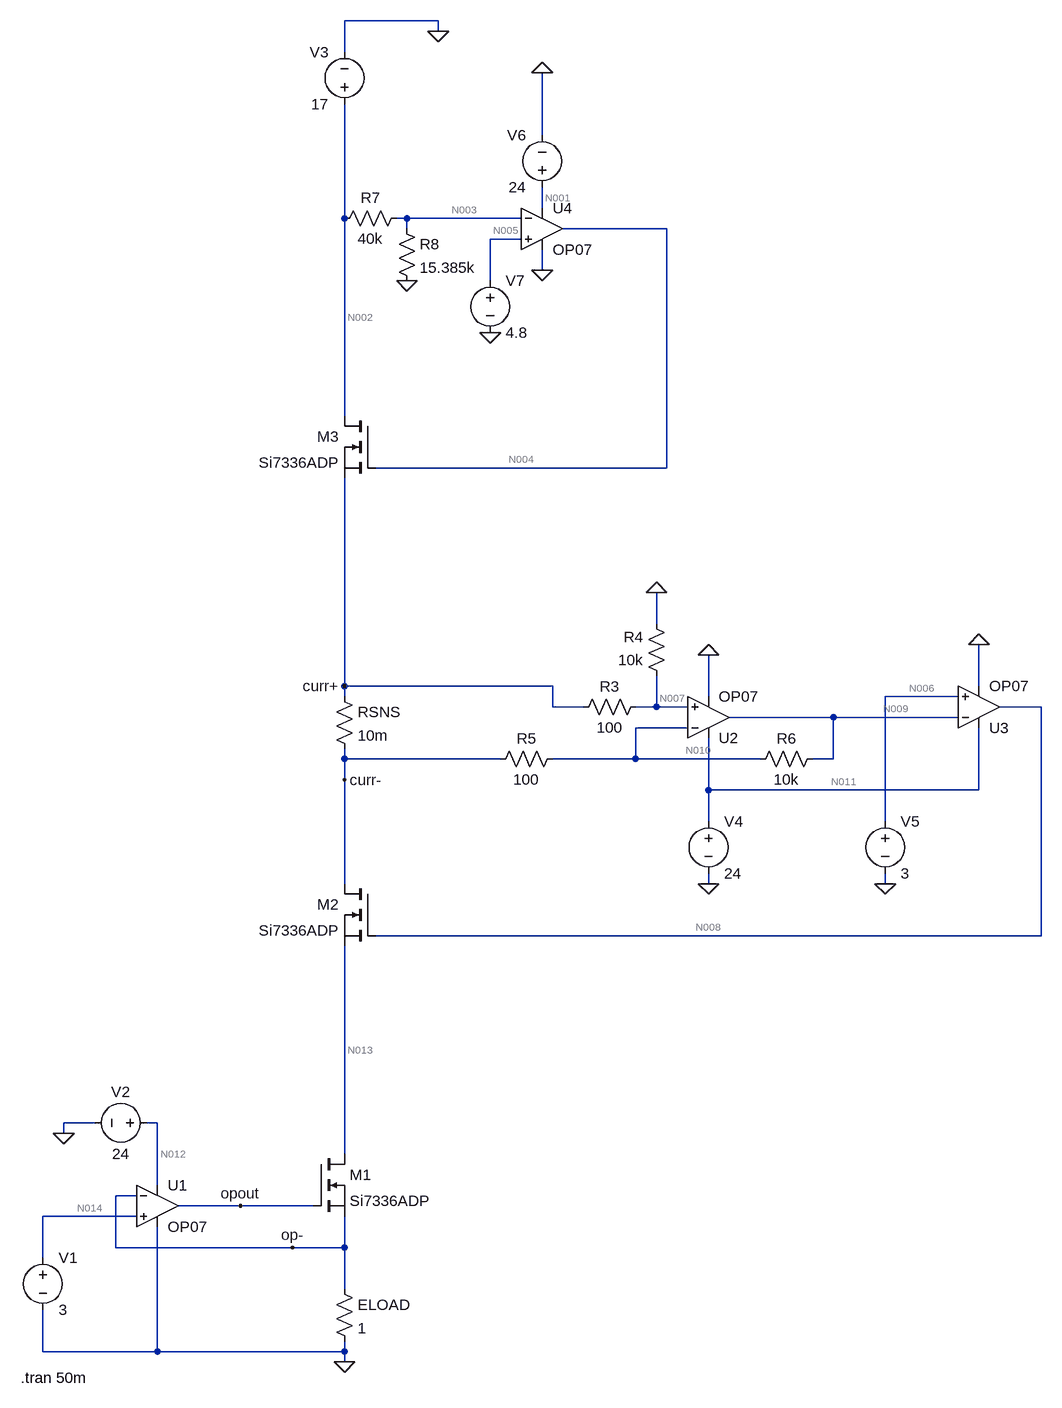
[diagram p0: schematic EloadSim.asc]
EloadSim.asc, the LTspice schematic file:
Version 4
SHEET 1 1540 680
WIRE 608 -1664 464 -1664
WIRE 608 -1648 608 -1664
WIRE 464 -1616 464 -1664
WIRE 768 -1488 768 -1584
WIRE 768 -1376 768 -1408
WIRE 464 -1360 464 -1536
WIRE 560 -1360 544 -1360
WIRE 736 -1360 560 -1360
WIRE 560 -1344 560 -1360
WIRE 960 -1344 800 -1344
WIRE 736 -1328 688 -1328
WIRE 768 -1280 768 -1312
WIRE 688 -1264 688 -1328
WIRE 464 -1056 464 -1360
WIRE 960 -976 960 -1344
WIRE 960 -976 512 -976
WIRE 944 -736 944 -784
WIRE 464 -640 464 -960
WIRE 784 -640 464 -640
WIRE 1440 -640 1440 -704
WIRE 464 -624 464 -640
WIRE 1024 -624 1024 -688
WIRE 1408 -624 1296 -624
WIRE 784 -608 784 -640
WIRE 832 -608 784 -608
WIRE 944 -608 944 -656
WIRE 944 -608 912 -608
WIRE 992 -608 944 -608
WIRE 1536 -608 1472 -608
WIRE 1216 -592 1056 -592
WIRE 1408 -592 1216 -592
WIRE 992 -576 912 -576
WIRE 464 -528 464 -544
WIRE 704 -528 464 -528
WIRE 912 -528 912 -576
WIRE 912 -528 784 -528
WIRE 1104 -528 912 -528
WIRE 1216 -528 1216 -592
WIRE 1216 -528 1184 -528
WIRE 464 -496 464 -528
WIRE 1024 -480 1024 -560
WIRE 1440 -480 1440 -576
WIRE 1440 -480 1024 -480
WIRE 1024 -432 1024 -480
WIRE 1296 -432 1296 -624
WIRE 464 -336 464 -496
WIRE 1024 -336 1024 -352
WIRE 1296 -336 1296 -352
WIRE 1536 -256 1536 -608
WIRE 1536 -256 512 -256
WIRE 80 32 32 32
WIRE 176 32 160 32
WIRE 32 48 32 32
WIRE 464 80 464 -240
WIRE 176 128 176 32
WIRE 144 144 112 144
WIRE 304 160 208 160
WIRE 416 160 304 160
WIRE 144 176 0 176
WIRE 112 224 112 144
WIRE 384 224 112 224
WIRE 464 224 464 176
WIRE 464 224 384 224
WIRE 0 240 0 176
WIRE 464 288 464 224
WIRE 0 384 0 320
WIRE 176 384 176 192
WIRE 176 384 0 384
WIRE 464 384 464 368
WIRE 464 384 176 384
WIRE 464 400 464 384
FLAG 464 400 0
FLAG 32 48 0
FLAG 608 -1648 0
FLAG 304 160 opout
FLAG 384 224 op-
FLAG 464 -640 curr+
FLAG 464 -496 curr-
FLAG 1024 -336 0
FLAG 1296 -336 0
FLAG 944 -784 0
FLAG 1024 -688 0
FLAG 1440 -704 0
FLAG 560 -1264 0
FLAG 768 -1280 0
FLAG 768 -1584 0
FLAG 688 -1184 0
SYMBOL OpAmps\\OP07 176 96 R0
SYMATTR InstName U1
SYMBOL nmos 416 80 R0
SYMATTR InstName M1
SYMATTR Value Si7336ADP
SYMBOL res 448 272 R0
SYMATTR InstName ELOAD
SYMATTR Value 1
SYMBOL voltage 0 224 R0
WINDOW 123 0 0 Left 0
WINDOW 39 0 0 Left 0
SYMATTR InstName V1
SYMATTR Value 3
SYMBOL voltage 176 32 R90
WINDOW 0 -32 56 VBottom 2
WINDOW 3 32 56 VTop 2
WINDOW 123 0 0 Left 0
WINDOW 39 0 0 Left 0
SYMATTR InstName V2
SYMATTR Value 24
SYMBOL voltage 464 -1520 R180
WINDOW 0 24 96 Left 2
WINDOW 3 24 16 Left 2
WINDOW 123 0 0 Left 0
WINDOW 39 0 0 Left 0
SYMATTR InstName V3
SYMATTR Value 17
SYMBOL res 448 -640 R0
SYMATTR InstName RSNS
SYMATTR Value 10m
SYMBOL OpAmps\\OP07 1024 -528 M180
SYMATTR InstName U2
SYMBOL voltage 1024 -448 R0
WINDOW 123 0 0 Left 0
WINDOW 39 0 0 Left 0
SYMATTR InstName V4
SYMATTR Value 24
SYMBOL res 928 -624 R90
WINDOW 0 0 56 VBottom 2
WINDOW 3 32 56 VTop 2
SYMATTR InstName R3
SYMATTR Value 100
SYMBOL res 960 -640 R180
WINDOW 0 36 76 Left 2
WINDOW 3 36 40 Left 2
SYMATTR InstName R4
SYMATTR Value 10k
SYMBOL res 800 -544 R90
WINDOW 0 0 56 VBottom 2
WINDOW 3 32 56 VTop 2
SYMATTR InstName R5
SYMATTR Value 100
SYMBOL res 1200 -544 R90
WINDOW 0 0 56 VBottom 2
WINDOW 3 32 56 VTop 2
SYMATTR InstName R6
SYMATTR Value 10k
SYMBOL OpAmps\\OP07 1440 -544 M180
SYMATTR InstName U3
SYMBOL voltage 1296 -448 R0
WINDOW 123 0 0 Left 0
WINDOW 39 0 0 Left 0
SYMATTR InstName V5
SYMATTR Value 3
SYMBOL nmos 512 -336 M0
SYMATTR InstName M2
SYMATTR Value Si7336ADP
SYMBOL res 560 -1376 R90
WINDOW 0 0 56 VBottom 2
WINDOW 3 32 56 VTop 2
SYMATTR InstName R7
SYMATTR Value 40k
SYMBOL res 544 -1360 R0
SYMATTR InstName R8
SYMATTR Value 15.385k
SYMBOL OpAmps\\OP07 768 -1408 R0
SYMATTR InstName U4
SYMBOL voltage 768 -1392 R180
WINDOW 0 24 96 Left 2
WINDOW 3 24 16 Left 2
WINDOW 123 0 0 Left 0
WINDOW 39 0 0 Left 0
SYMATTR InstName V6
SYMATTR Value 24
SYMBOL nmos 512 -1056 M0
SYMATTR InstName M3
SYMATTR Value Si7336ADP
SYMBOL voltage 688 -1280 R0
WINDOW 123 0 0 Left 0
WINDOW 39 0 0 Left 0
SYMATTR InstName V7
SYMATTR Value 4.8
TEXT -34 424 Left 2 !.tran 50m

The netlist it stands for:
* EloadSim.asc
XU1 N014 op- N012 0 opout LT1001  ; OP07, pins In+ In- V+ V- OUT
M1 N013 opout op- op- Si7336ADP
R§ELOAD op- 0 1
V1 N014 0 3
V2 N012 0 24
V3 N002 0 17
RSNS curr+ curr- 10m
XU2 N007 N010 N011 0 N009 LT1001  ; OP07, pins In+ In- V+ V- OUT
V4 N011 0 24
R3 N007 curr+ 100
R4 N007 0 10k
R5 N010 curr- 100
R6 N009 N010 10k
XU3 N006 N009 N011 0 N008 LT1001  ; OP07, pins In+ In- V+ V- OUT
V5 N006 0 3
M2 curr- N008 N013 N013 Si7336ADP
R7 N003 N002 40k
R8 N003 0 15.385k
XU4 N005 N003 N001 0 N004 LT1001  ; OP07, pins In+ In- V+ V- OUT
V6 N001 0 24
M3 N002 N004 curr+ curr+ Si7336ADP
V7 N005 0 4.8
.model NMOS NMOS
.model PMOS PMOS
.lib standard.mos
.tran 50m
.lib LTC.lib
.backanno
.end

* Results of the author's LTspice run, read from the files saved beside the schematic
* Operating Point, zero values left out:
*   V(op-) = 2.997 V
*   V(n014) = 3 V
*   V(n012) = 24 V
*   V(opout) = 23.06 V
*   V(n013) = 3.004 V
*   V(n002) = 17 V
*   V(curr+) = 16.99 V
*   V(curr-) = 16.96 V
*   V(n010) = 16.82 V
*   V(n007) = 16.82 V
*   V(n011) = 24 V
*   V(n009) = 3 V
*   V(n006) = 3 V
*   V(n008) = 6.014 V
*   V(n003) = 4.722 V
*   V(n005) = 4.8 V
*   V(n001) = 24 V
*   V(n004) = 23.07 V
*   Id(M3) = 3 A
*   Is(M3) = -3 A
*   Id(M2) = 2.997 A
*   Is(M2) = -2.997 A
*   Id(M1) = 2.997 A
*   Is(M1) = -2.997 A
*   I(R8) = 306.9 µA
*   I(R7) = -306.9 µA
*   I(R6) = -1.382 mA
*   I(R5) = -1.382 mA
*   I(R4) = 1.682 mA
*   I(R3) = -1.682 mA
*   I(Rsns) = 2.999 A
*   I(Eload) = 2.997 A
*   I(V7) = -1.036 nA
*   I(V6) = -2.247 mA
*   I(V5) = 16.18 pA
*   I(V4) = -3.862 mA
*   I(V3) = -3.001 A
*   I(V2) = -2.25 mA
*   I(V1) = -18.9 pA